# Altium schematic sheet Key-RTC.SchDoc
size A3
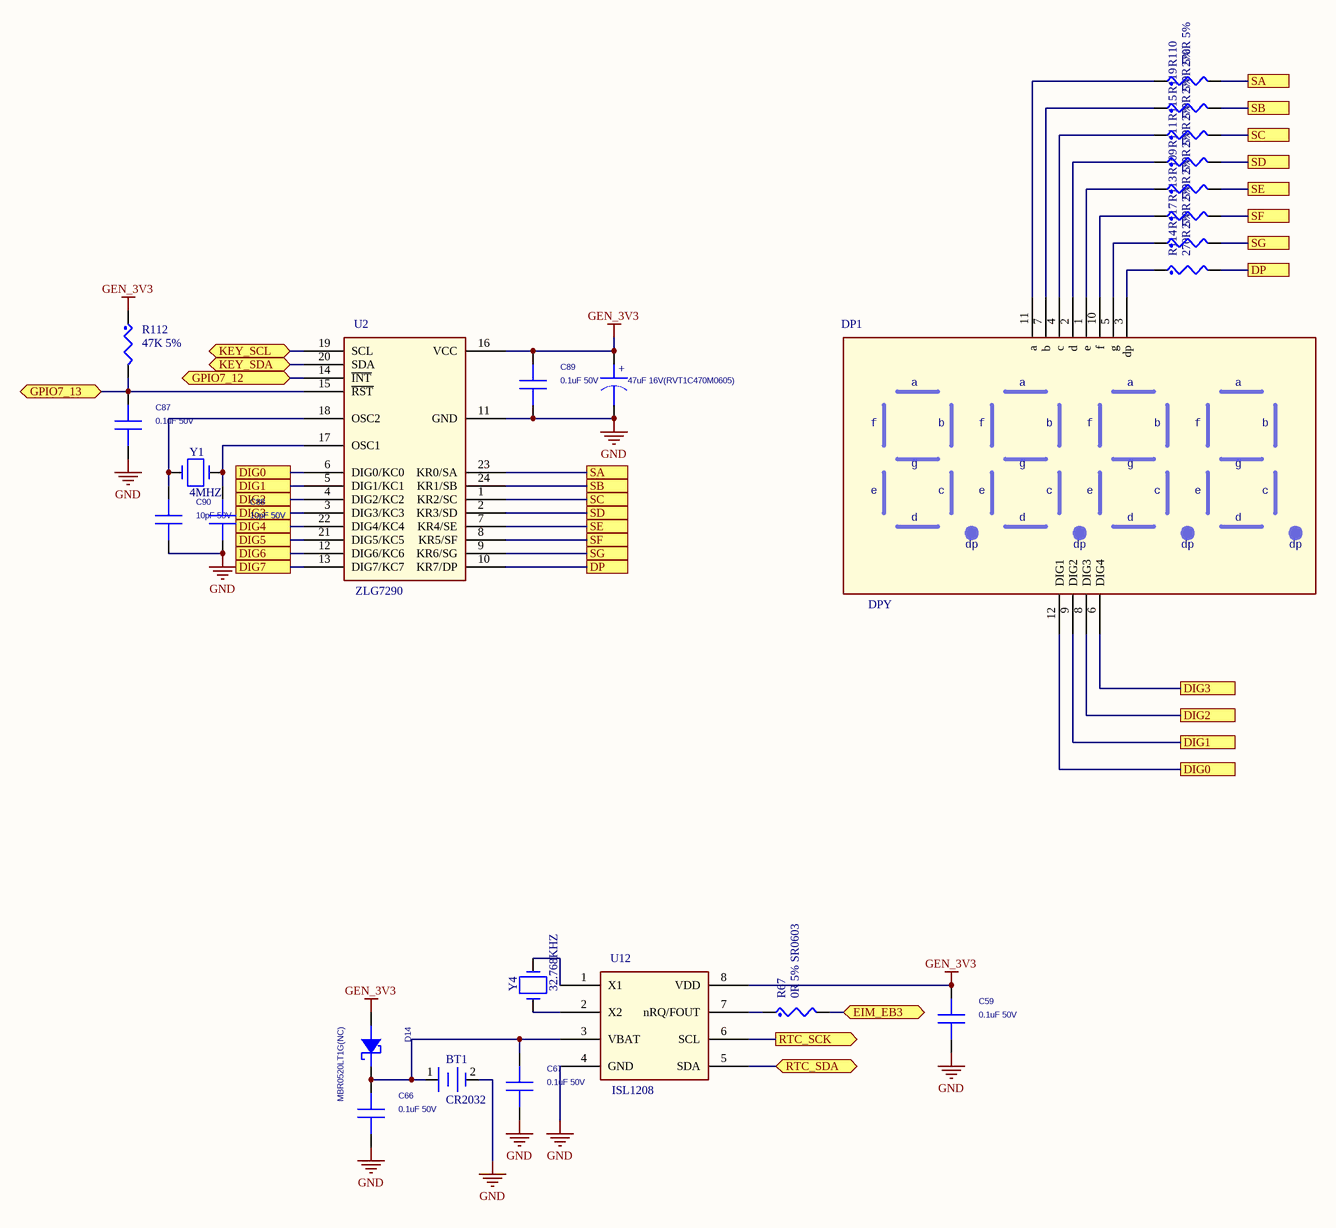
[diagram p0: Key-RTC.SchDoc]

## Parts
BT1  CR2032  [CR2032]
C11  47uF 16V(RVT1C470M0605)  [SCA6P3X5P4]
C59  0.1uF 50V  [SC0603]
C66  0.1uF 50V  [SC0603]
C67  0.1uF 50V  [SC0603]
C87  0.1uF 50V  [SC0603]
C88  10pF 50V  [SC0603]
C89  0.1uF 50V  [SC0603]
C90  10pF 50V  [SC0603]
D14  MBR0520LT1G(NC)  [SOD123]
DP1  DPY  [LEDTUBE-14X30]
R67  0R 5% SR0603  [SR0603]
R109  270R 5%  [SR0603]
R110  270R 5%  [SR0603]
R111  270R 5%  [SR0603]
R112  47K 5%  [SR0603]
R113  270R 5%  [SR0603]
R114  270R 5%  [SR0603]
R115  270R 5%  [SR0603]
R117  270R 5%  [SR0603]
R119  270R 5%  [SR0603]
U2  ZLG7290  [SOP24-1P27-15X10P5]
U12  ISL1208  [SOP8-1p27-5x4]
Y1  4MHZ  [XTAL-2-5P08]
Y4  32.768KHZ  [SCRY2-3X1P5]

## Ports
DIG0, DIG1, DIG2, DIG3, DIG4, DIG5, DIG6, DIG7, DP, EIM_EB3 (bidir), GPIO7_12 (bidir), GPIO7_13 (bidir), KEY_SCL (bidir), KEY_SDA (bidir), RTC_SCK (out), RTC_SDA (bidir), SA, SB, SC, SD, SE, SF, SG

## Nets
GEN_3V3: C11.1 C59.1 C89.1 D14.1(ANODE) R112.1 U2.16(VCC) U12.8(VDD)
GND: BT1.2 C11.2 C59.2 C66.2 C67.2 C87.2 C88.2 C89.2 C90.2 U2.11(GND) U12.4(GND)
DIG0: DP1.12(DIG1) U2.6(DIG0/KC0) ; port DIG0
DIG1: DP1.9(DIG2) U2.5(DIG1/KC1) ; port DIG1
DIG2: DP1.8(DIG3) U2.4(DIG2/KC2) ; port DIG2
DIG3: DP1.6(DIG4) U2.3(DIG3/KC3) ; port DIG3
DIG4: U2.22(DIG4/KC4) ; port DIG4
DIG5: U2.21(DIG5/KC5) ; port DIG5
DIG6: U2.12(DIG6/KC6) ; port DIG6
DIG7: U2.13(DIG7/KC7) ; port DIG7
DP: R114.2 U2.10(KR7/DP) ; port DP
EIM_EB3: R67.2 ; port EIM_EB3
GPIO7_12: U2.14(~{INT}) ; port GPIO7_12
GPIO7_13: C87.1 R112.2 U2.15(~{RST}) ; port GPIO7_13
KEY_SCL: U2.19(SCL) ; port KEY_SCL
KEY_SDA: U2.20(SDA) ; port KEY_SDA
RTC_SCK: U12.6(SCL) ; port RTC_SCK
RTC_SDA: U12.5(SDA) ; port RTC_SDA
SA: R110.2 U2.23(KR0/SA) ; port SA
SB: R119.2 U2.24(KR1/SB) ; port SB
SC: R115.2 U2.1(KR2/SC) ; port SC
SD: R111.2 U2.2(KR3/SD) ; port SD
SE: R109.2 U2.7(KR4/SE) ; port SE
SF: R113.2 U2.8(KR5/SF) ; port SF
SG: R117.2 U2.9(KR6/SG) ; port SG
NetBT1_1: BT1.1 C66.1 C67.1 D14.2(CATHODE) U12.3(VBAT)
NetC88_1: C88.1 U2.17(OSC1) Y1.2
NetC90_1: C90.1 U2.18(OSC2) Y1.1
NetDP1_1: DP1.1(e) R109.1
NetDP1_2: DP1.2(d) R111.1
NetDP1_3: DP1.3(dp) R114.1
NetDP1_4: DP1.4(c) R115.1
NetDP1_5: DP1.5(g) R117.1
NetDP1_7: DP1.7(b) R119.1
NetDP1_10: DP1.10(f) R113.1
NetDP1_11: DP1.11(a) R110.1
NetR67_1: R67.1 U12.7(nRQ/FOUT)
NetU12_1: U12.1(X1) Y4.2
NetU12_2: U12.2(X2) Y4.1

## Notes on the sheet
- (in symbol 100uF-6.3V-20%-AL-LOESR-SMD_5x5) +

## Library data of the parts
BT1 = BATTERY
C11 = 100uF-6.3V-20%-AL-LOESR-SMD_5x5: SCA6p3x5p4; Mfg2_PN: EEE-FPJ101UAR; DNP: No; Cost_1K: 0.071; Cost_100: 0.1324; Dist1: United Chemi-Con; Dist1_PN: EMZA6R3ADA101ME61G; Dielectric: Aluminum; Tolerance: 20%; Device: CAPE_RAD_5_SMT; Mfg2: Panasonic; Cost: 0.188; Mfg1_PN: EMZA6R3ADA101ME61G; Mfg1: United Chemi-Con
C59 C66 C67 C87-C90 = 0.1uF-6.3V-10%-X5R-0402: Capacitor, 0.1uF, 50V, 10%, X5R, 0603; Cost_100: 0.0184; Cost_1K: 0.01005; Dist1: Digikey; Dist1_PN: PCC2146CT-ND; Device: CAP0402; Mfg1_PN: ECJ-0EB1A104K; Mfg1: Panasonic; Voltage: 6.3V; Cost_Reel: 0.00871; Mfg2_PN: MCCJ104K0NRTF; DNP: No; Cost: 0.026; Dielectric: X5R; TOLERANCE: 10%; Mfg2: SMEC
D14 = DIODE SCHOTTKY_Dup1: SOD123
R67 = RES: CLASS: DISCRETE
R109-R115 R117 R119 = RES: SR0603; CLASS: DISCRETE
U2 = ZLG7290: SOP24-1p27-15x10p5
U12 = ISL1208: SL1208  SOP8-1p27-5x4
Y1 = CRYSTAL_0: XTAL-2-5p08
Y4 = CRYSTAL_0: SCRY2-3x1p5